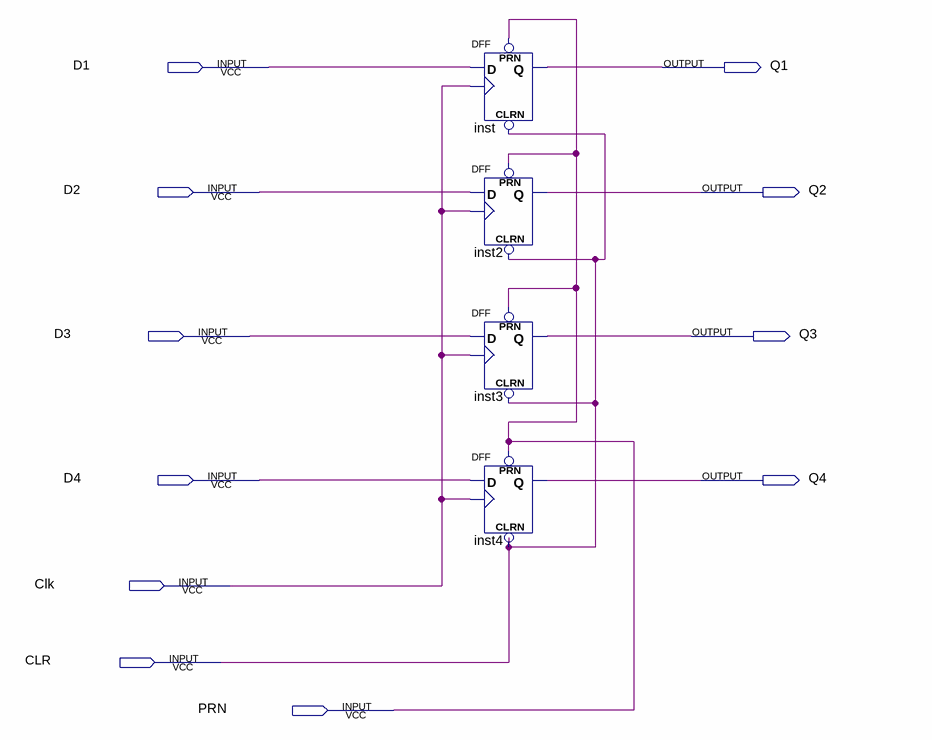
[diagram p0: schematic sheet]
// Quartus schematic Register.bdf as structural Verilog: 4 symbols, 11 pins
module Register (
  input  D1,
  input  D2,
  input  D3,
  input  D4,
  input  Clk,
  input  CLR,
  input  PRN,
  output Q1,
  output Q2,
  output Q3,
  output Q4
);

  DFF inst (.CLRN(CLR), .CLK(Clk), .D(D1), .PRN(PRN), .Q(Q1));
  DFF inst2 (.CLRN(CLR), .CLK(Clk), .D(D2), .PRN(PRN), .Q(Q2));
  DFF inst3 (.CLRN(CLR), .CLK(Clk), .D(D3), .PRN(PRN), .Q(Q3));
  DFF inst4 (.CLRN(CLR), .CLK(Clk), .D(D4), .PRN(PRN), .Q(Q4));
endmodule
